# EAGLE schematic ADE7753_Breakout (EAGLE 6.3)
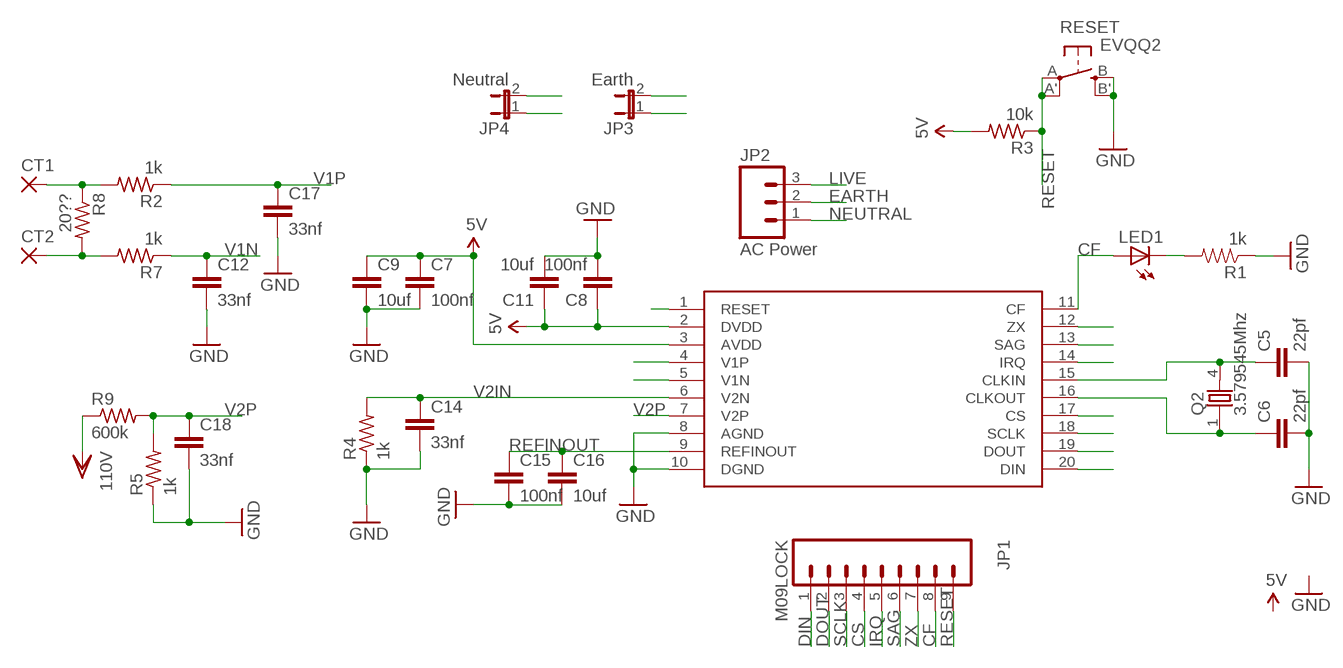
[diagram p0: schematic, sheet 1]

## Parts
C5  22pf  CAP0805  [0805]
C6  22pf  CAP0805  [0805]
C7  100nf  CAP0805  [0805]
C8  100nf  CAP0805  [0805]
C9  10uf  CAP0805  [0805]
C11  10uf  CAP0805  [0805]
C12  33nf  CAP0805  [0805]
C14  33nf  CAP0805  [0805]
C15  100nf  CAP0805  [0805]
C16  10uf  CAP0805  [0805]
C17  33nf  CAP0805  [0805]
C18  33nf  CAP0805  [0805]
CT1  2,54/1,0  [2,54/1,0]
CT2  2,54/1,0  [2,54/1,0]
JP1  M09LOCK  [1X09_LOCK]
JP2  AC Power  M03SCREW_LOCK  [SCREWTERMINAL-3.5MM-3_LOCK.007S]
JP3  Earth  JUMPER-2PTH_LOCK  [1X02_LOCK]
JP4  Neutral  JUMPER-2PTH_LOCK  [1X02_LOCK]
LED1  LEDCHIP-LED0805  [CHIP-LED0805]
Q2  3.579545Mhz  86SMX  [86SMX]
R1  1k  RESISTOR  [0805]
R2  1k  R-US_R0805  [R0805]
R3  10k  R-US_R0805  [R0805]
R4  1k  R-US_R0805  [R0805]
R5  1k  R-US_R0805  [R0805]
R7  1k  R-US_R0805  [R0805]
R8  20??  R-US_R0805  [R0805]
R9  600k  R-US_R0805  [R0805]
RESET  EVQQ2  [EVQ-Q2]
U$1  ADE7753  [SSOP20]

## Nets
5V [5v]: C7.1 C8.1 C9.1 C11.1 R3.2 U$1.2(DVDD) U$1.3(AVDD)
CF: JP1.8 LED1.A U$1.11(CF)
CLKIN: C5.1 Q2.4 U$1.15(CLKIN)
CLKOUT: C6.1 Q2.1 U$1.16(CLKOUT)
CS: JP1.4 U$1.17(CS)
DIN: JP1.1 U$1.20(DIN)
DOUT: JP1.2 U$1.19(DOUT)
EARTH [acpower]: JP2.2 JP3.2
GND [gnd]: C5.2 C6.2 C7.2 C8.2 C9.2 C11.2 C12.2 C14.2 C15.2 C16.2 C17.2 C18.2 JP3.1 JP4.1 R1.1 R4.1 R5.1 RESET.B'(S1) RESET.B(S) U$1.8(AGND) U$1.10(DGND)
IRQ: JP1.5 U$1.14(IRQ)
LIVE [acpower]: JP2.3 R9.1 ; supply symbol labelled 110V
N$1: CT1.1(P) R2.2 R8.1
N$2: CT2.1(P) R7.2 R8.2
N$27: LED1.C R1.2
NEUTRAL [acpower]: JP2.1 JP4.2
REFINOUT: C15.1 C16.1 U$1.9(REFINOUT)
RESET: JP1.9 R3.1 RESET.A'(P1) RESET.A(P) U$1.1(RESET)
SAG: JP1.6 U$1.13(SAG)
SCLK: JP1.3 U$1.18(SCLK)
V1N: C12.1 R7.1 U$1.5(V1N)
V1P: C17.1 R2.1 U$1.4(V1P)
V2IN: C14.1 R4.2 U$1.6(V2N)
V2P: C18.1 R5.2 R9.2 U$1.7(V2P)
ZX: JP1.7 U$1.12(ZX)

## Library data of the parts
C5-C9 C11 C12 C14-C18 = SparkFun-Passives:CAP: Capacitor Standard 0603 ceramic capacitor, and 0.1" leaded capacitor.
CT1 CT2 = wirepad:2,54/1,0: THROUGH-HOLE PAD
JP1 = SparkFun-Connectors:M09: Header 9 Standard 9-pin 0.1" header. Use with straight break away headers (SKU : PRT-00116), right angle break away headers (PRT-00553), swiss pins (PRT-00743), machine pins (PRT-00117), and female headers (PRT-00115).
JP2 = SparkFun-Connectors:M03: Header 3 Standard 3-pin 0.1" header. Use with straight break away headers (SKU : PRT-00116), right angle break away headers (PRT-00553), swiss pins (PRT-00743), machine pins (PRT-00117), and female headers (PRT-00115). Molex polarized connector foot print use with SKU : PRT-08232 with associated crimp pins and housings.
JP3 JP4 = SparkFun-Passives:JUMPER-2: Jumper Basic 0.1" spaced jumper. Use with breakaway headers.
LED1 = led:LED: LED OSRAM: - CHIPLED LG R971, LG N971, LY N971, LG Q971, LY Q971, LO R971, LY R971 LH N974, LH R974 LS Q976, LO Q976, LY Q976 LO Q996 - Hyper CHIPLED LW Q18S LB Q993, LB Q99A, LB R99A - SideLED LS A670, LO A670, LY A670, LG A670, LP A670 LB A673, LV A673, LT A673, LW A673 LH A674 LY A675 LS A676, LA A676, LO A676, LY A676, LW A676 LS A679, LY A679, LG A679 - Hyper Micro SIDELED® LS Y876, LA Y876, LO Y876, LY Y876 LT Y87S - SmartLED LW L88C, LW L88S LB L89C, LB L89S, LG L890 LS L89K, LO L89K, LY L89K LS L896, LA L896, LO L896, LY L896 - TOPLED LS T670, LO T670, LY T670, LG T670, LP T670 LSG T670, LSP T670, LSY T670, LOP T670, LYG T670 LG T671, LOG T671, LSG T671 LB T673, LV T673, LT T673, LW T673 LH T674 LS T676, LA T676, LO T676, LY T676, LB T676, LH T676, LSB T676, LW T676 LB T67C, LV T67C, LT T67C, LS T67K, LO T67K, LY T67K, LW E67C LS E67B, LA E67B, LO E67B, LY E67B, LB E67C, LV E67C, LT E67C LW T67C LS T679, LY T679, LG T679 LS T770, LO T770, LY T770, LG T770, LP T770 LB T773, LV T773, LT T773, LW T773 LH T774 LS E675, LA E675, LY E675, LS T675 LS T776, LA T776, LO T776, LY T776, LB T776 LHGB T686 LT T68C, LB T68C - Hyper Mini TOPLED® LB M676 - Mini TOPLED Santana® LG M470 LS M47K, LO M47K, LY M47K Source: http://www.osram.convergy.de LUXEON: - LUMILED® LXK2-PW12-R00, LXK2-PW12-S00, LXK2-PW14-U00, LXK2-PW14-V00 LXK2-PM12-R00, LXK2-PM12-S00, LXK2-PM14-U00 LXK2-PE12-Q00, LXK2-PE12-R00, LXK2-PE12-S00, LXK2-PE14-T00, LXK2-PE14-U00 LXK2-PB12-K00, LXK2-PB12-L00, LXK2-PB12-M00, LXK2-PB14-N00, LXK2-PB14-P00, LXK2-PB14-Q00 LXK2-PR12-L00, LXK2-PR12-M00, LXK2-PR14-Q00, LXK2-PR14-R00 LXK2-PD12-Q00, LXK2-PD12-R00, LXK2-PD12-S00 LXK2-PH12-R00, LXK2-PH12-S00 LXK2-PL12-P00, LXK2-PL12-Q00, LXK2-PL12-R00 Source: www.luxeon.com KINGBRIGHT: KA-3528ASYC Source: www.kingbright.com
Q2 = crystal:86SMX: CRYSTAL; MF: C-MAC FREQUENCY PRODUCTS LTD; MPN: XTAL003321- 86SMX; OC_FARNELL: 6344914; OC_NEWARK: 01H9866
R1 = SparkFun:RESISTOR: Resistor Basic schematic elements and footprints for 0603, 1206, and PTH 1/10th watt (small) resistors.
R2-R5 R7-R9 = adafruit:R-US_: RESISTOR, American symbol
RESET = adaprog:EVQQ2
U$1 = ade7735:ADE7753

## Net classes
0 default: width 0.254 mm, drill 0.508 mm, clearance 0.254 mm
1 acpower: width 0.406 mm, drill 0.508 mm, clearance 0.762 mm
2 gnd: width 0.305 mm, drill 0.508 mm, clearance 0.254 mm
3 5v: width 0.254 mm, drill 0.508 mm, clearance 0.254 mm